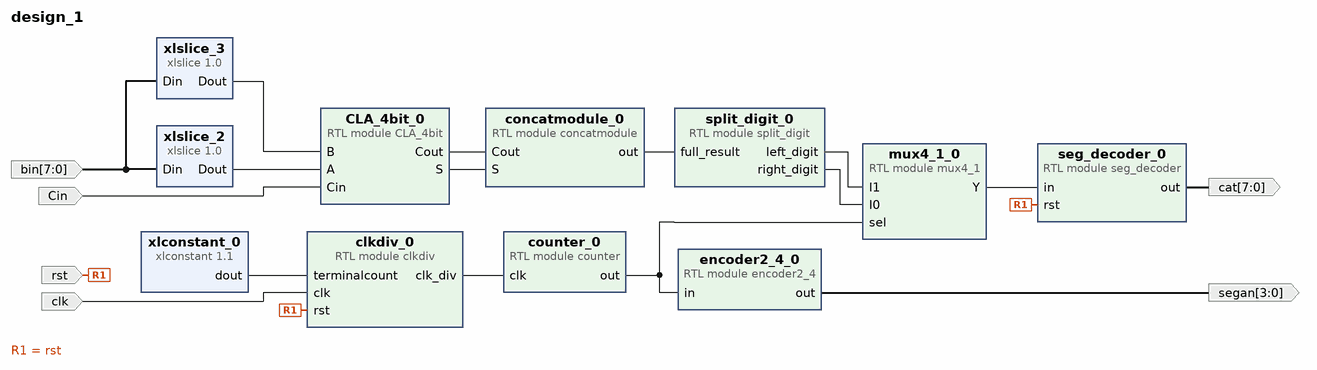
[diagram p0: block diagram of the top level]
# Vivado block design design_1, xc7z007sclg400-1, Vivado 2024.1.1
create_bd_design design_1

create_bd_port -dir I -from 7 -to 0 bin
create_bd_port -dir I Cin
create_bd_port -dir I rst
create_bd_port -dir I clk
create_bd_port -dir O -from 3 -to 0 segan
create_bd_port -dir O -from 7 -to 0 cat

create_bd_cell -type module -reference seg_decoder seg_decoder_0
create_bd_cell -type module -reference mux4_1 mux4_1_0
create_bd_cell -type ip -vlnv xilinx.com:ip:xlslice:1.0 xlslice_2
set_property -dict {CONFIG.DIN_FROM 3 CONFIG.DIN_WIDTH 8} [get_bd_cells xlslice_2]
create_bd_cell -type ip -vlnv xilinx.com:ip:xlslice:1.0 xlslice_3
set_property -dict {CONFIG.DIN_FROM 7 CONFIG.DIN_TO 4 CONFIG.DIN_WIDTH 8} [get_bd_cells xlslice_3]
create_bd_cell -type module -reference clkdiv clkdiv_0
create_bd_cell -type module -reference counter counter_0
create_bd_cell -type module -reference encoder2_4 encoder2_4_0
create_bd_cell -type ip -vlnv xilinx.com:ip:xlconstant:1.1 xlconstant_0
set_property -dict {CONFIG.CONST_VAL 19999 CONFIG.CONST_WIDTH 16} [get_bd_cells xlconstant_0]
create_bd_cell -type module -reference CLA_4bit CLA_4bit_0
create_bd_cell -type module -reference concatmodule concatmodule_0
create_bd_cell -type module -reference split_digit split_digit_0

# ---- connections ----

connect_bd_net [get_bd_pins CLA_4bit_0/Cout] [get_bd_pins concatmodule_0/Cout]
connect_bd_net [get_bd_pins CLA_4bit_0/S] [get_bd_pins concatmodule_0/S]
connect_bd_net [get_bd_ports Cin] [get_bd_pins CLA_4bit_0/Cin]
connect_bd_net [get_bd_ports bin] [get_bd_pins xlslice_2/Din] [get_bd_pins xlslice_3/Din]
connect_bd_net [get_bd_ports clk] [get_bd_pins clkdiv_0/clk]
connect_bd_net [get_bd_pins clkdiv_0/clk_div] [get_bd_pins counter_0/clk]
connect_bd_net [get_bd_pins concatmodule_0/out] [get_bd_pins split_digit_0/full_result]
connect_bd_net [get_bd_pins counter_0/out] [get_bd_pins encoder2_4_0/in] [get_bd_pins mux4_1_0/sel]
connect_bd_net [get_bd_pins encoder2_4_0/out] [get_bd_ports segan]
connect_bd_net [get_bd_pins mux4_1_0/Y] [get_bd_pins seg_decoder_0/in]
connect_bd_net [get_bd_ports rst] [get_bd_pins clkdiv_0/rst] [get_bd_pins seg_decoder_0/rst]
connect_bd_net [get_bd_pins seg_decoder_0/out] [get_bd_ports cat]
connect_bd_net [get_bd_pins split_digit_0/left_digit] [get_bd_pins mux4_1_0/I1]
connect_bd_net [get_bd_pins split_digit_0/right_digit] [get_bd_pins mux4_1_0/I0]
connect_bd_net [get_bd_pins xlconstant_0/dout] [get_bd_pins clkdiv_0/terminalcount]
connect_bd_net [get_bd_pins xlslice_2/Dout] [get_bd_pins CLA_4bit_0/A]
connect_bd_net [get_bd_pins xlslice_3/Dout] [get_bd_pins CLA_4bit_0/B]

validate_bd_design
save_bd_design
